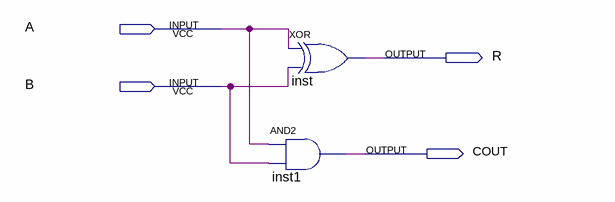
[diagram p0: schematic sheet]
// Quartus schematic HA.bdf as structural Verilog: 2 symbols, 4 pins
module HA (
  input  A,
  input  B,
  output R,
  output COUT
);

  xor inst (R, A, B);
  and inst1 (COUT, A, B);
endmodule
